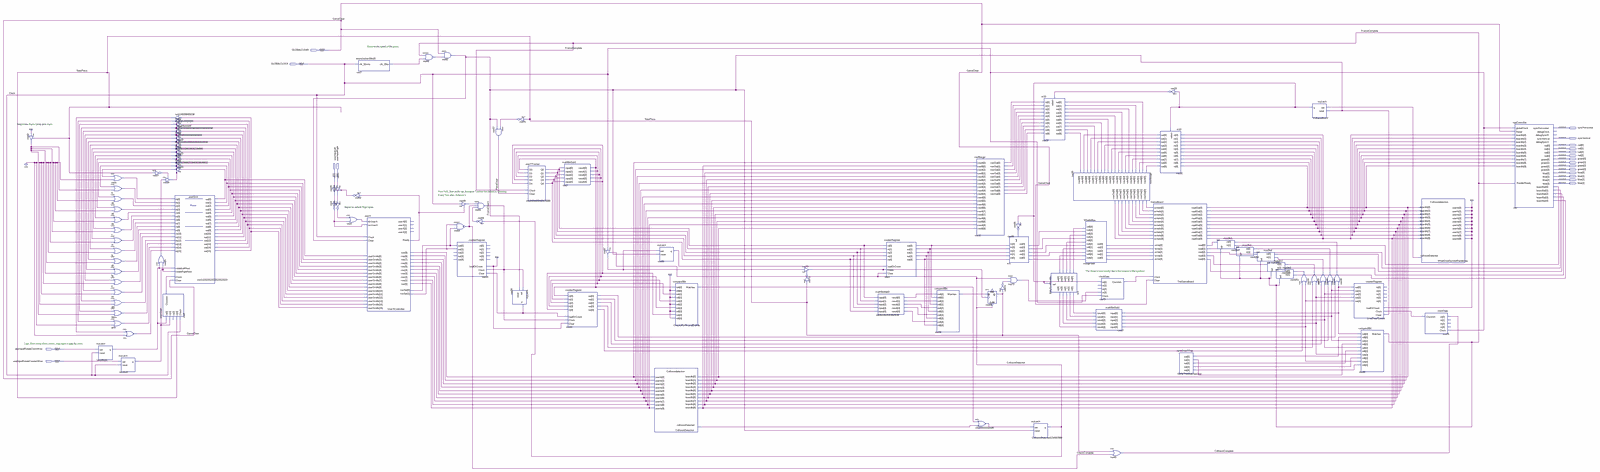
[diagram p0: schematic sheet, whole]
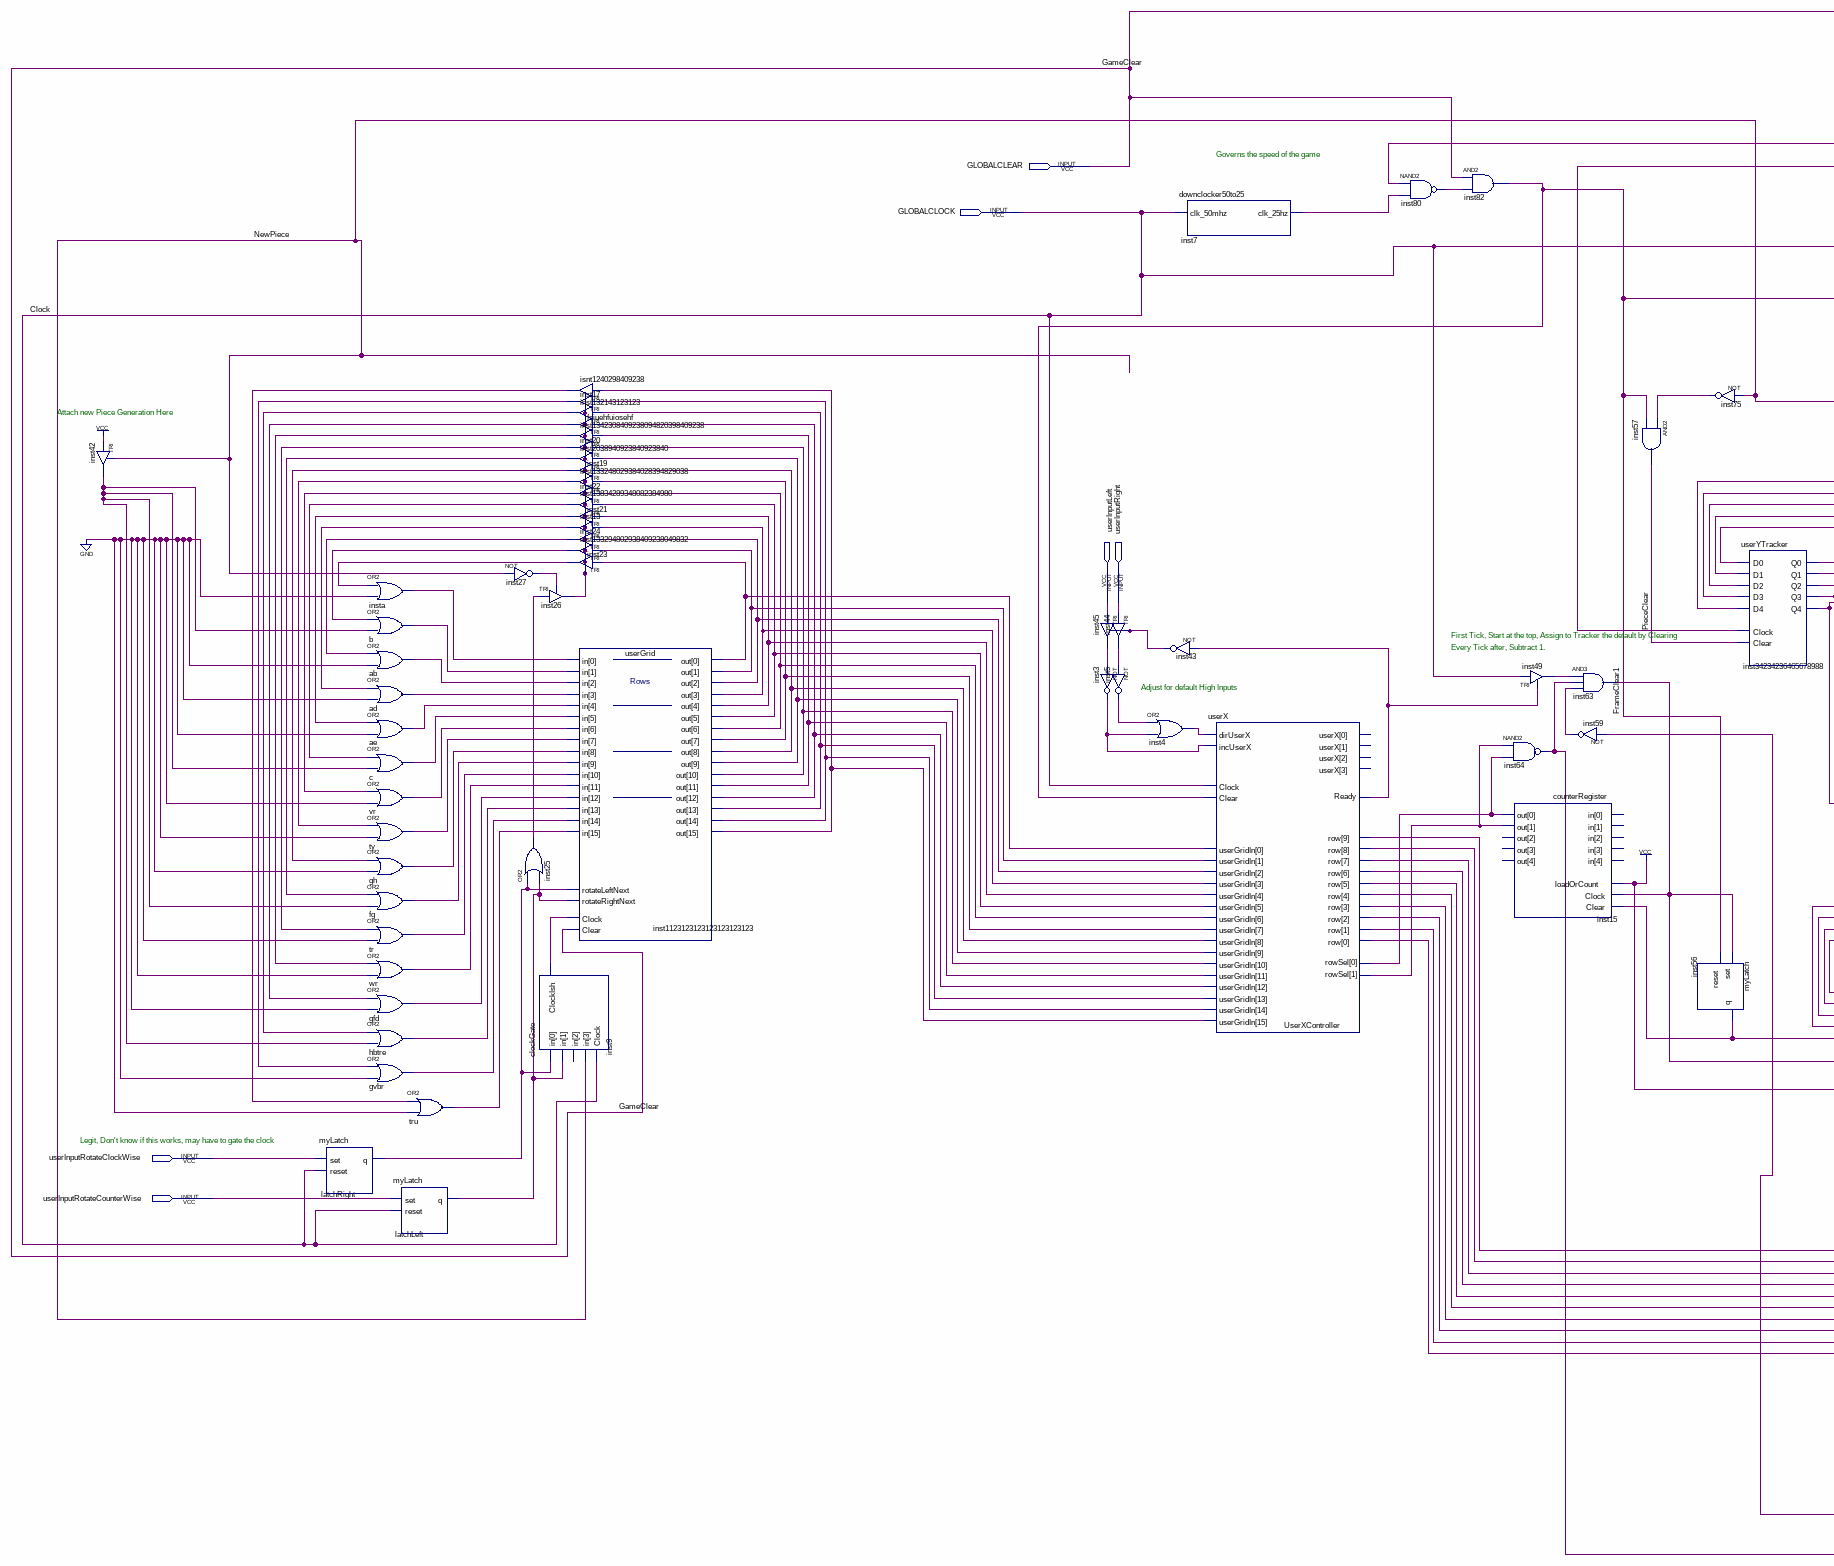
[diagram p1: schematic sheet, left part]
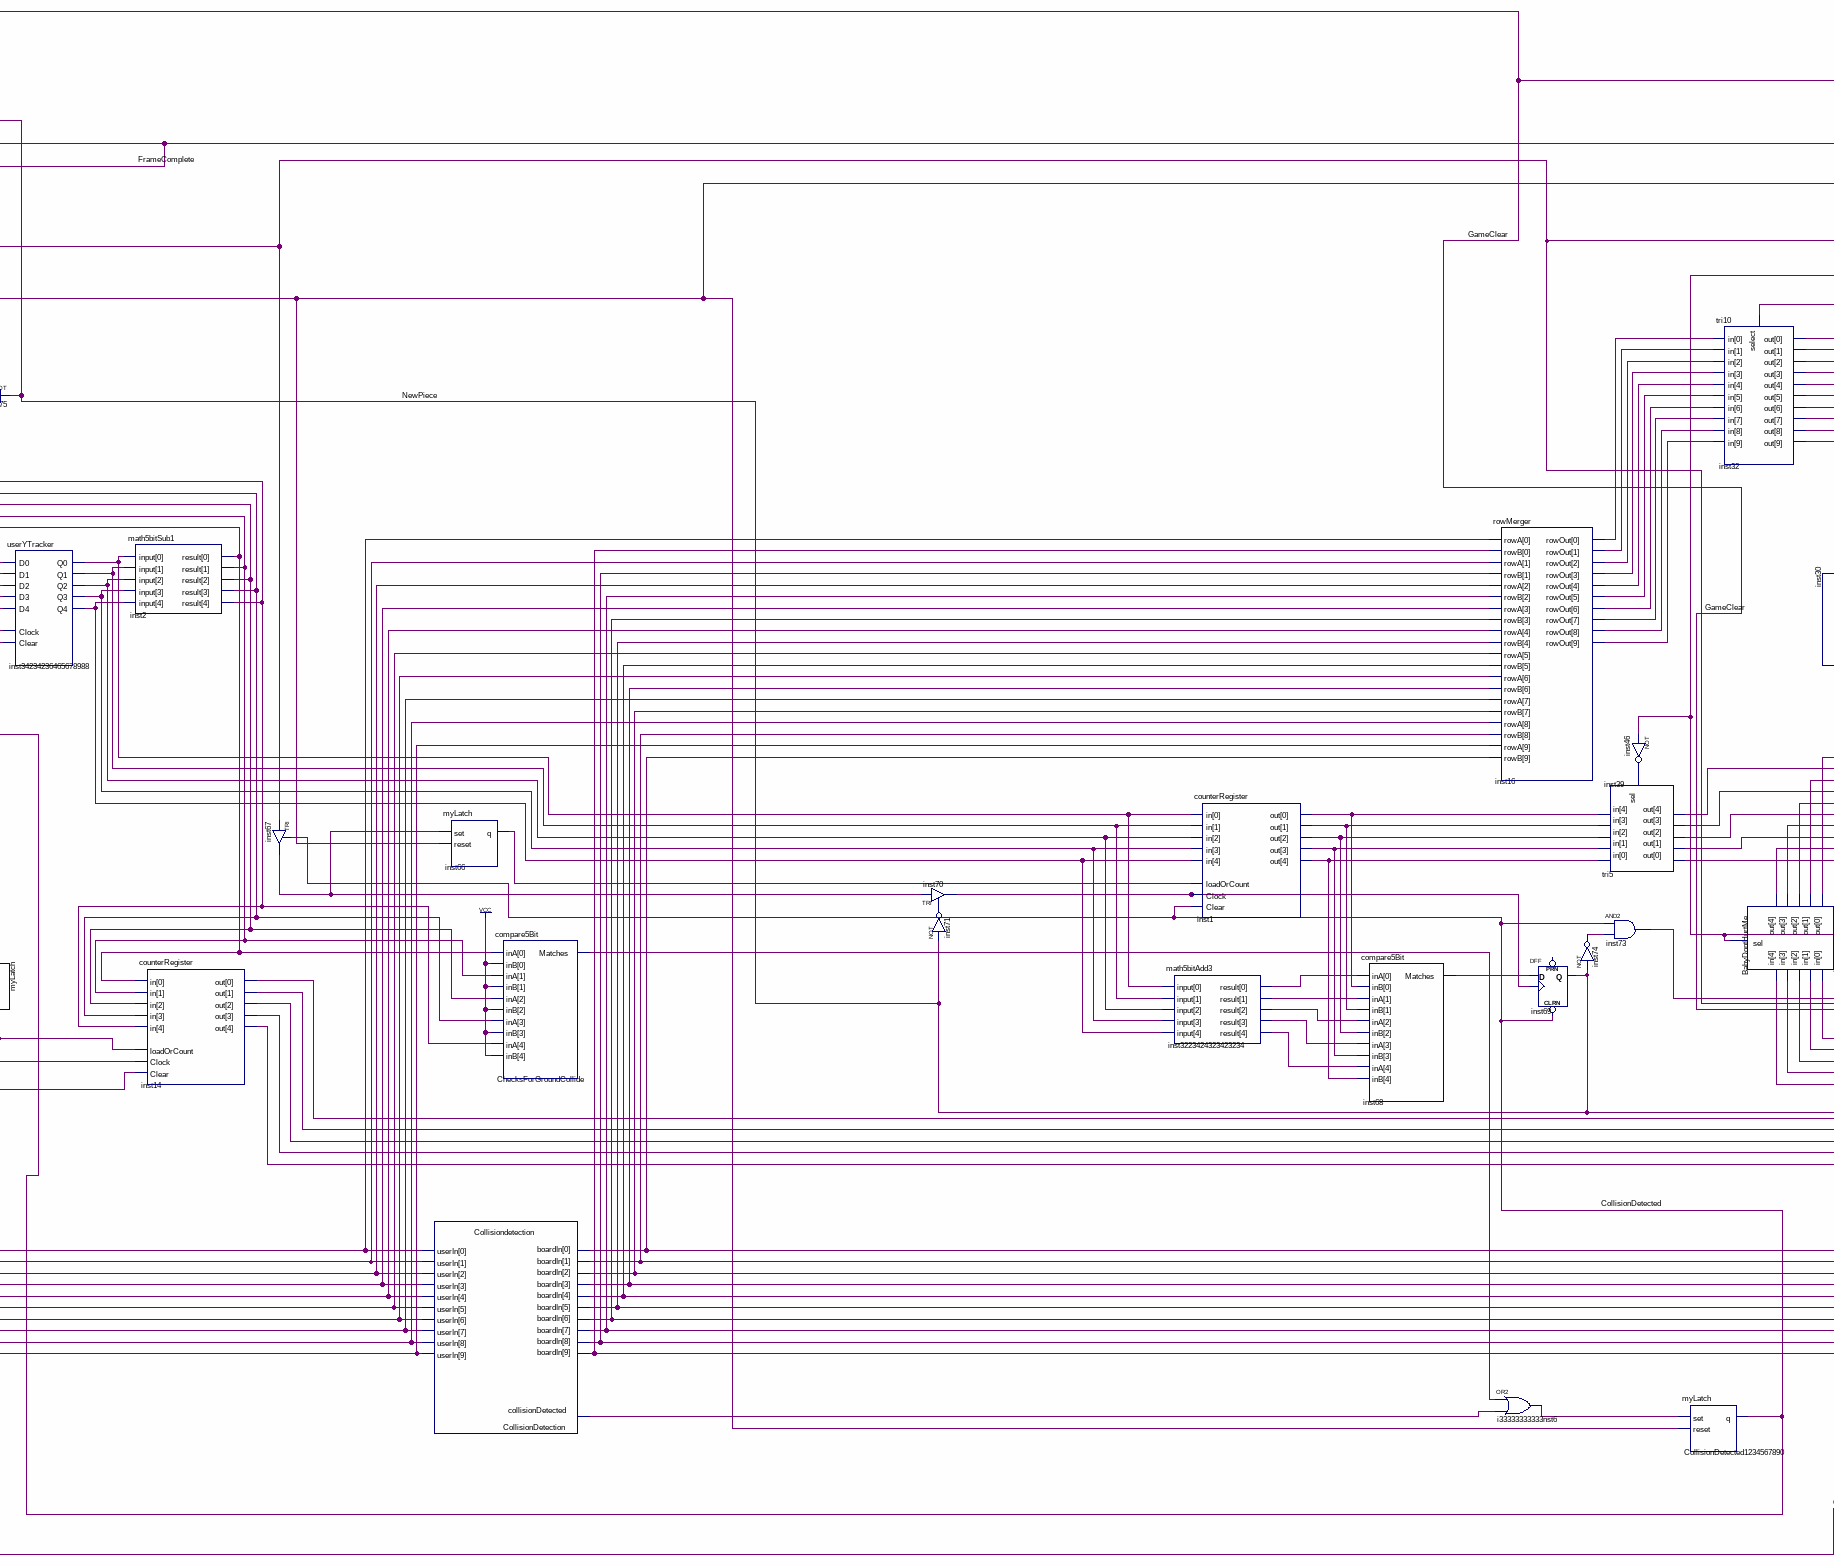
[diagram p2: schematic sheet, centre part]
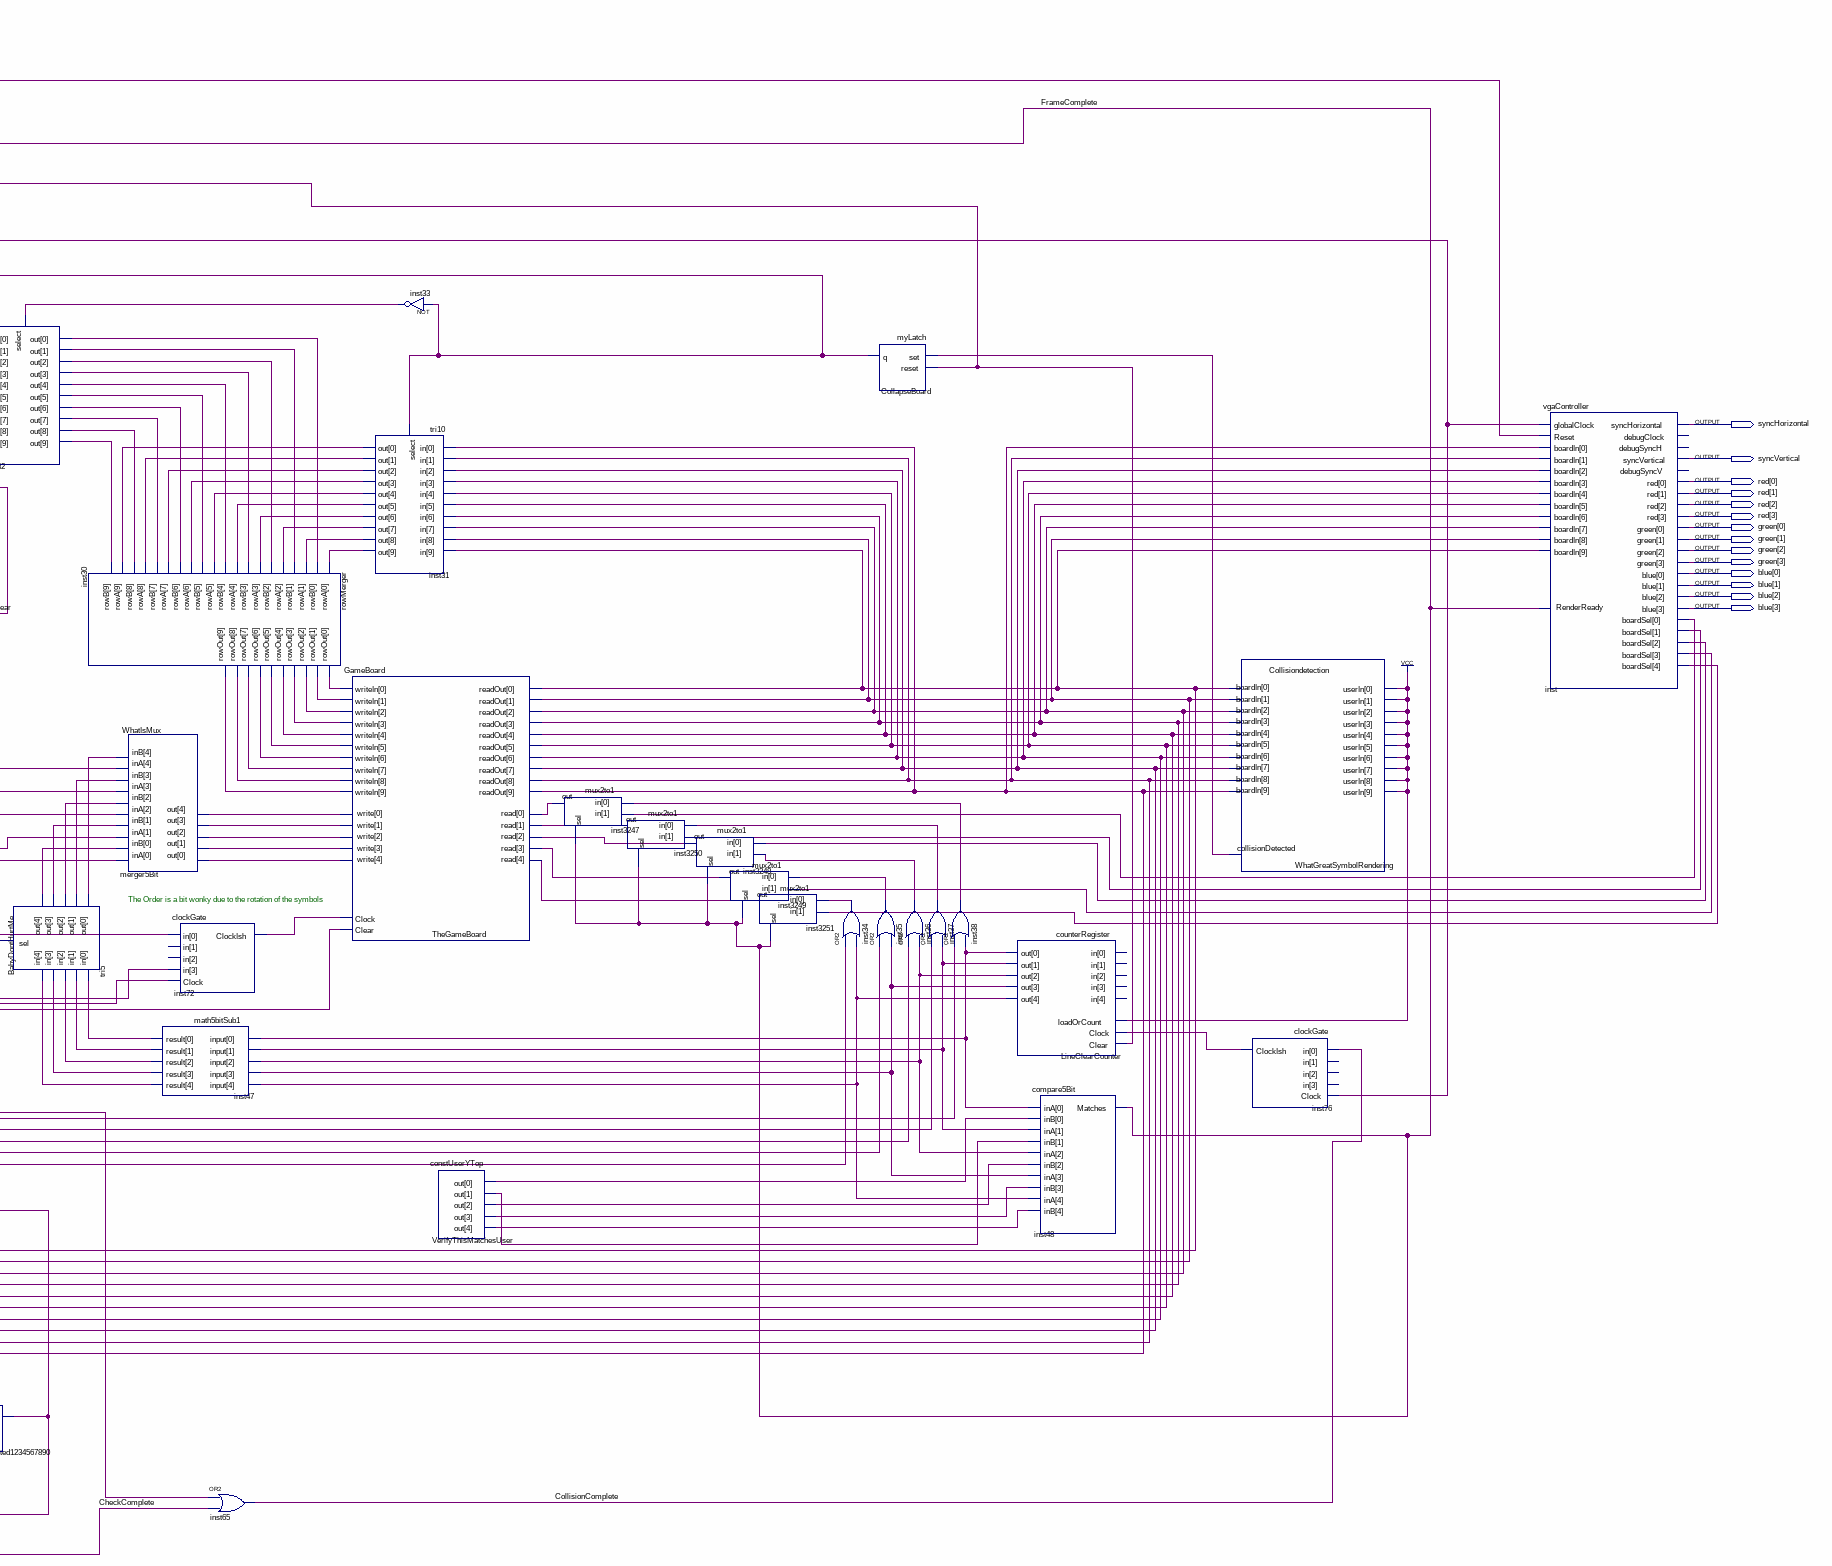
[diagram p3: schematic sheet, right part]
// Quartus schematic GameLogic.bdf as structural Verilog: 105 symbols, 20 pins
module GameLogic (
  input  GLOBALCLEAR,
  input  GLOBALCLOCK,
  input  userInputLeft,
  input  userInputRight,
  input  userInputRotateClockWise,
  input  userInputRotateCounterWise,
  output syncHorizontal,
  output syncVertical,
  output [3:0] red,
  output [3:0] green,
  output [3:0] blue
);

  wire ab_out, ad_out, ae_out, b_out, BabyDontHurtMe_out, BabyDontHurtMe_out_2, BabyDontHurtMe_out_3,
       BabyDontHurtMe_out_4, BabyDontHurtMe_out_5, c_out, CheckComplete, ChecksForGroundCollide_matches,
       CollapseBoard_q, CollisionComplete, CollisionDetected, CollisionDetection_collisiondetected, fg_out,
       FrameClear1, FrameComplete, fsiuehfuiosehf_out, gfd_out, gh_out, gvbr_out, hbtre_out,
       i33333333333nst6_out, inst1_out, inst1_out_2, inst1_out_3, inst1_out_4, inst1_out_5, inst2_result,
       inst2_result_2, inst2_result_3, inst2_result_4, inst2_result_5, inst3_out, inst4_out, inst5_out,
       inst7_clk_25hz, inst9_clockish, inst13_out, inst14_out, inst14_out_2, inst14_out_3, inst14_out_4,
       inst14_out_5, inst15_out, inst15_out_2, inst16_rowout, inst16_rowout_2, inst16_rowout_3,
       inst16_rowout_4, inst16_rowout_5, inst16_rowout_6, inst16_rowout_7, inst16_rowout_8, inst16_rowout_9,
       inst16_rowout_10, inst17_out, inst19_out, inst20_out, inst21_out, inst22_out, inst23_out, inst24_out,
       inst25_out, inst26_out, inst27_out, inst30_rowout, inst30_rowout_2, inst30_rowout_3, inst30_rowout_4,
       inst30_rowout_5, inst30_rowout_6, inst30_rowout_7, inst30_rowout_8, inst30_rowout_9, inst30_rowout_10,
       inst31_out, inst31_out_2, inst31_out_3, inst31_out_4, inst31_out_5, inst31_out_6, inst31_out_7,
       inst31_out_8, inst31_out_9, inst31_out_10, inst32_out, inst32_out_2, inst32_out_3, inst32_out_4,
       inst32_out_5, inst32_out_6, inst32_out_7, inst32_out_8, inst32_out_9, inst32_out_10, inst33_out,
       inst34_out, inst35_out, inst36_out, inst37_out, inst38_out, inst39_out, inst39_out_2, inst39_out_3,
       inst39_out_4, inst39_out_5, inst42_out, inst43_out, inst44_out, inst45_out, inst46_out, inst47_result,
       inst47_result_2, inst47_result_3, inst47_result_4, inst47_result_5, inst49_out, inst56_q, inst59_out,
       inst63_out, inst66_q, inst67_out, inst68_matches, inst70_out, inst71_out, inst72_clockish, inst73_out,
       inst74_out, inst75_out, inst76_clockish, inst80_out, inst3247_out, inst3248_out, inst3249_out,
       inst3250_out, inst3251_out, inst132143123123_out, inst3223424323423234_result,
       inst3223424323423234_result_2, inst3223424323423234_result_3, inst3223424323423234_result_4,
       inst3223424323423234_result_5, inst34234236465678988_q0, inst34234236465678988_q1,
       inst34234236465678988_q2, inst34234236465678988_q3, inst34234236465678988_q4,
       inst2038940923840923840_out, inst13834289348082384980_out, inst1123123123123123123123_out,
       inst1123123123123123123123_out_2, inst1123123123123123123123_out_3, inst1123123123123123123123_out_4,
       inst1123123123123123123123_out_5, inst1123123123123123123123_out_6, inst1123123123123123123123_out_7,
       inst1123123123123123123123_out_8, inst1123123123123123123123_out_9, inst1123123123123123123123_out_10,
       inst1123123123123123123123_out_11, inst1123123123123123123123_out_12,
       inst1123123123123123123123_out_13, inst1123123123123123123123_out_14,
       inst1123123123123123123123_out_15, inst1123123123123123123123_out_16,
       inst133248029384028394829038_out, inst133294802938409238049832_out,
       inst1342308409238094820398409238_out, inst_boardsel, inst_boardsel_2, inst_boardsel_3,
       inst_boardsel_4, inst_boardsel_5, insta_out, isnt1240298409238_out, latchLeft_q, latchRight_q,
       LineClearCounter_out, LineClearCounter_out_2, LineClearCounter_out_3, LineClearCounter_out_4,
       LineClearCounter_out_5, NewPiece, PieceClear, TheGameBoard_readout, TheGameBoard_readout_2,
       TheGameBoard_readout_3, TheGameBoard_readout_4, TheGameBoard_readout_5, TheGameBoard_readout_6,
       TheGameBoard_readout_7, TheGameBoard_readout_8, TheGameBoard_readout_9, TheGameBoard_readout_10,
       tr_out, tru_out, ty_out, UserXController_ready, UserXController_row, UserXController_row_2,
       UserXController_row_3, UserXController_row_4, UserXController_row_5, UserXController_row_6,
       UserXController_row_7, UserXController_row_8, UserXController_row_9, UserXController_row_10,
       VerifyThisMatchesUser_out, VerifyThisMatchesUser_out_2, VerifyThisMatchesUser_out_3,
       VerifyThisMatchesUser_out_4, VerifyThisMatchesUser_out_5, vr_out,
       WhatGreatSymbolRendering_collisiondetected, WhatIsMux_out, WhatIsMux_out_2, WhatIsMux_out_3,
       WhatIsMux_out_4, WhatIsMux_out_5, wr_out;
  wire [4:0] inst15_out_open;  // unused outputs

  TRI inst42 (.IN(1'b1), .OE(NewPiece), .OUT(inst42_out));
  myLatch latchRight (.set(userInputRotateClockWise), .reset(GLOBALCLOCK), .q(latchRight_q));
  or insta (insta_out, inst23_out, 1'b0);
  or b (b_out, inst133294802938409238049832_out, inst42_out);
  or ab (ab_out, inst24_out, 1'b0);
  or ad (ad_out, inst13_out, 1'b0);
  or ae (ae_out, inst21_out, 1'b0);
  or c (c_out, inst13834289348082384980_out, inst42_out);
  or vr (vr_out, inst22_out, 1'b0);
  or ty (ty_out, inst133248029384028394829038_out, 1'b0);
  or gh (gh_out, inst19_out, 1'b0);
  or fg (fg_out, inst2038940923840923840_out, inst42_out);
  or tr (tr_out, inst20_out, 1'b0);
  or wr (wr_out, inst1342308409238094820398409238_out, 1'b0);
  or gfd (gfd_out, fsiuehfuiosehf_out, 1'b0);
  or hbtre (hbtre_out, inst132143123123_out, inst42_out);
  or gvbr (gvbr_out, inst17_out, 1'b0);
  or tru (tru_out, isnt1240298409238_out, 1'b0);
  myLatch latchLeft (.set(userInputRotateCounterWise), .reset(GLOBALCLOCK), .q(latchLeft_q));
  not inst27 (inst27_out, NewPiece);
  or inst25 (inst25_out, latchRight_q, latchLeft_q);
  TRI inst26 (.IN(inst25_out), .OE(inst27_out), .OUT(inst26_out));
  clockGate inst9 (.in({NewPiece, 1'bz, latchLeft_q, latchRight_q}), .Clock(GLOBALCLOCK), .ClockIsh(inst9_clockish));
  TRI isnt1240298409238 (.IN(inst1123123123123123123123_out_16), .OE(inst26_out), .OUT(isnt1240298409238_out));
  TRI inst17 (.IN(inst1123123123123123123123_out_15), .OE(inst26_out), .OUT(inst17_out));
  TRI inst132143123123 (.IN(inst1123123123123123123123_out_14), .OE(inst26_out), .OUT(inst132143123123_out));
  TRI fsiuehfuiosehf (.IN(inst1123123123123123123123_out_13), .OE(inst26_out), .OUT(fsiuehfuiosehf_out));
  TRI inst1342308409238094820398409238 (
    .IN(inst1123123123123123123123_out_12), .OE(inst26_out), .OUT(inst1342308409238094820398409238_out));
  TRI inst20 (.IN(inst1123123123123123123123_out_11), .OE(inst26_out), .OUT(inst20_out));
  TRI inst2038940923840923840 (
    .IN(inst1123123123123123123123_out_10), .OE(inst26_out), .OUT(inst2038940923840923840_out));
  TRI inst19 (.IN(inst1123123123123123123123_out_9), .OE(inst26_out), .OUT(inst19_out));
  TRI inst133248029384028394829038 (
    .IN(inst1123123123123123123123_out_8), .OE(inst26_out), .OUT(inst133248029384028394829038_out));
  TRI inst22 (.IN(inst1123123123123123123123_out_7), .OE(inst26_out), .OUT(inst22_out));
  TRI inst13834289348082384980 (
    .IN(inst1123123123123123123123_out_6), .OE(inst26_out), .OUT(inst13834289348082384980_out));
  TRI inst21 (.IN(inst1123123123123123123123_out_5), .OE(inst26_out), .OUT(inst21_out));
  TRI inst13 (.IN(inst1123123123123123123123_out_4), .OE(inst26_out), .OUT(inst13_out));
  TRI inst24 (.IN(inst1123123123123123123123_out_3), .OE(inst26_out), .OUT(inst24_out));
  TRI inst133294802938409238049832 (
    .IN(inst1123123123123123123123_out_2), .OE(inst26_out), .OUT(inst133294802938409238049832_out));
  TRI inst23 (.IN(inst1123123123123123123123_out), .OE(inst26_out), .OUT(inst23_out));
  userGrid inst1123123123123123123123 (
    .in({tru_out, gvbr_out, hbtre_out, gfd_out, wr_out, tr_out, fg_out, gh_out, ty_out, vr_out, c_out, ae_out, ad_out, ab_out, b_out, insta_out}),
    .Clock(inst9_clockish), .Clear(GLOBALCLEAR), .rotateLeftNext(latchRight_q),
    .rotateRightNext(latchLeft_q),
    .out({inst1123123123123123123123_out_16, inst1123123123123123123123_out_15, inst1123123123123123123123_out_14, inst1123123123123123123123_out_13, inst1123123123123123123123_out_12, inst1123123123123123123123_out_11, inst1123123123123123123123_out_10, inst1123123123123123123123_out_9, inst1123123123123123123123_out_8, inst1123123123123123123123_out_7, inst1123123123123123123123_out_6, inst1123123123123123123123_out_5, inst1123123123123123123123_out_4, inst1123123123123123123123_out_3, inst1123123123123123123123_out_2, inst1123123123123123123123_out}));
  TRI inst44 (.IN(userInputRight), .OE(inst43_out), .OUT(inst44_out));
  TRI inst45 (.IN(userInputLeft), .OE(inst43_out), .OUT(inst45_out));
  not inst3 (inst3_out, inst45_out);
  not inst5 (inst5_out, inst44_out);
  or inst4 (inst4_out, inst5_out, inst3_out);
  downclocker50to25 inst7 (.clk_50mhz(GLOBALCLOCK), .clk_25hz(inst7_clk_25hz));
  not inst43 (inst43_out, UserXController_ready);
  userX UserXController (
    .dirUserX(inst4_out), .Clock(GLOBALCLOCK), .incUserX(inst3_out), .Clear(FrameClear1),
    .userGridIn({inst1123123123123123123123_out_16, inst1123123123123123123123_out_15, inst1123123123123123123123_out_14, inst1123123123123123123123_out_13, inst1123123123123123123123_out_12, inst1123123123123123123123_out_11, inst1123123123123123123123_out_10, inst1123123123123123123123_out_9, inst1123123123123123123123_out_8, inst1123123123123123123123_out_7, inst1123123123123123123123_out_6, inst1123123123123123123123_out_5, inst1123123123123123123123_out_4, inst1123123123123123123123_out_3, inst1123123123123123123123_out_2, inst1123123123123123123123_out}),
    .rowSel({inst15_out_2, inst15_out}),
    .row({UserXController_row_9, UserXController_row_10, UserXController_row_8, UserXController_row_7, UserXController_row_6, UserXController_row_5, UserXController_row_4, UserXController_row_3, UserXController_row_2, UserXController_row}),
    .Ready(UserXController_ready));  // open: userX
  nand inst80 (inst80_out, FrameComplete, inst7_clk_25hz);
  and inst82 (FrameClear1, GLOBALCLEAR, inst80_out);
  TRI inst49 (.IN(GLOBALCLOCK), .OE(UserXController_ready), .OUT(inst49_out));
  nand inst64 (CheckComplete, inst15_out_2, inst15_out);
  counterRegister inst15 (
    .loadOrCount(1'b1), .Clock(inst63_out), .Clear(inst56_q),
    .out({inst15_out_open[4:2], inst15_out_2, inst15_out}));  // open: in
  and inst63 (inst63_out, inst49_out, CheckComplete, inst59_out);
  not inst59 (inst59_out, CollisionDetected);
  and inst57 (PieceClear, inst75_out, FrameClear1);
  not inst75 (inst75_out, NewPiece);
  myLatch inst56 (.set(inst63_out), .reset(FrameClear1), .q(inst56_q));
  userYTracker inst34234236465678988 (
    .D1(inst2_result_2), .D3(inst2_result_4), .D4(inst2_result_5), .D0(inst2_result), .D2(inst2_result_3),
    .Clock(FrameComplete), .Clear(PieceClear), .Q0(inst34234236465678988_q0), .Q1(inst34234236465678988_q1),
    .Q2(inst34234236465678988_q2), .Q3(inst34234236465678988_q3), .Q4(inst34234236465678988_q4));
  math5bitSub1 inst2 (
    .\input ({inst34234236465678988_q4, inst34234236465678988_q3, inst34234236465678988_q2, inst34234236465678988_q1, inst34234236465678988_q0}),
    .result({inst2_result_5, inst2_result_4, inst2_result_3, inst2_result_2, inst2_result}));
  counterRegister inst14 (
    .in({inst2_result_5, inst2_result_4, inst2_result_3, inst2_result_2, inst2_result}),
    .loadOrCount(inst56_q), .Clock(inst63_out), .Clear(1'b1),
    .out({inst14_out_5, inst14_out_4, inst14_out_3, inst14_out_2, inst14_out}));
  TRI inst67 (.IN(GLOBALCLOCK), .OE(CollisionDetected), .OUT(inst67_out));
  Collisiondetection CollisionDetection (
    .userIn({UserXController_row, UserXController_row_2, UserXController_row_3, UserXController_row_4, UserXController_row_5, UserXController_row_6, UserXController_row_7, UserXController_row_8, UserXController_row_10, UserXController_row_9}),
    .boardIn({TheGameBoard_readout_6, TheGameBoard_readout_7, TheGameBoard_readout_8, TheGameBoard_readout_9, TheGameBoard_readout_10, TheGameBoard_readout_5, TheGameBoard_readout_4, TheGameBoard_readout_3, TheGameBoard_readout_2, TheGameBoard_readout}),
    .collisionDetected(CollisionDetection_collisiondetected));
  myLatch inst66 (.set(inst67_out), .reset(FrameClear1), .q(inst66_q));
  compare5Bit ChecksForGroundCollide (
    .inA({inst2_result_5, inst2_result_4, inst2_result_3, inst2_result_2, inst2_result}), .inB({5{1'b1}}),
    .Matches(ChecksForGroundCollide_matches));
  TRI inst70 (.IN(inst67_out), .OE(inst71_out), .OUT(inst70_out));
  not inst71 (inst71_out, NewPiece);
  math5bitAdd3 inst3223424323423234 (
    .\input ({inst34234236465678988_q4, inst34234236465678988_q3, inst34234236465678988_q2, inst34234236465678988_q1, inst34234236465678988_q0}),
    .result({inst3223424323423234_result_5, inst3223424323423234_result_3, inst3223424323423234_result_2, inst3223424323423234_result_4, inst3223424323423234_result}));
  counterRegister inst1 (
    .in({inst34234236465678988_q4, inst34234236465678988_q3, inst34234236465678988_q2, inst34234236465678988_q1, inst34234236465678988_q0}),
    .loadOrCount(inst66_q), .Clock(inst70_out), .Clear(CollisionDetected),
    .out({inst1_out, inst1_out_2, inst1_out_3, inst1_out_4, inst1_out_5}));
  compare5Bit inst68 (
    .inA({inst3223424323423234_result_5, inst3223424323423234_result_3, inst3223424323423234_result_2, inst3223424323423234_result_4, inst3223424323423234_result}),
    .inB({inst1_out, inst1_out_2, inst1_out_3, inst1_out_4, inst1_out_5}), .Matches(inst68_matches));
  rowMerger inst16 (
    .rowA({UserXController_row, UserXController_row_2, UserXController_row_3, UserXController_row_4, UserXController_row_5, UserXController_row_6, UserXController_row_7, UserXController_row_8, UserXController_row_10, UserXController_row_9}),
    .rowB({TheGameBoard_readout, TheGameBoard_readout_2, TheGameBoard_readout_3, TheGameBoard_readout_4, TheGameBoard_readout_5, TheGameBoard_readout_10, TheGameBoard_readout_9, TheGameBoard_readout_8, TheGameBoard_readout_7, TheGameBoard_readout_6}),
    .rowOut({inst16_rowout_7, inst16_rowout_5, inst16_rowout_8, inst16_rowout_4, inst16_rowout_9, inst16_rowout_3, inst16_rowout_10, inst16_rowout_6, inst16_rowout_2, inst16_rowout}));
  DFF inst69 (.CLRN(CollisionDetected), .CLK(inst70_out), .D(inst68_matches), .Q(NewPiece));  // open: PRN
  or i33333333333nst6 (i33333333333nst6_out, ChecksForGroundCollide_matches, CollisionDetection_collisiondetected);
  not inst74 (inst74_out, NewPiece);
  not inst46 (inst46_out, CollapseBoard_q);
  tri5 inst39 (
    .in({inst1_out_5, inst1_out_4, inst1_out_3, inst1_out_2, inst1_out}), .sel(inst46_out),
    .out({inst39_out, inst39_out_2, inst39_out_4, inst39_out_3, inst39_out_5}));
  and inst73 (inst73_out, CollisionDetected, inst74_out);
  tri10 inst32 (
    .in({inst16_rowout_7, inst16_rowout_5, inst16_rowout_8, inst16_rowout_4, inst16_rowout_9, inst16_rowout_3, inst16_rowout_10, inst16_rowout_6, inst16_rowout_2, inst16_rowout}),
    .select(inst33_out),
    .out({inst32_out, inst32_out_2, inst32_out_3, inst32_out_4, inst32_out_5, inst32_out_6, inst32_out_7, inst32_out_8, inst32_out_9, inst32_out_10}));
  myLatch CollisionDetected1234567890 (.set(i33333333333nst6_out), .reset(FrameClear1), .q(CollisionDetected));
  tri5 BabyDontHurtMe (
    .in({inst47_result_4, inst47_result_3, inst47_result_2, inst47_result, inst47_result_5}),
    .sel(CollapseBoard_q),
    .out({BabyDontHurtMe_out_5, BabyDontHurtMe_out_4, BabyDontHurtMe_out, BabyDontHurtMe_out_3, BabyDontHurtMe_out_2}));
  rowMerger inst30 (
    .rowA({inst31_out_10, inst31_out_9, inst31_out_8, inst31_out_7, inst31_out_6, inst31_out_5, inst31_out_4, inst31_out_3, inst31_out_2, inst31_out}),
    .rowB({inst32_out, inst32_out_2, inst32_out_3, inst32_out_4, inst32_out_5, inst32_out_6, inst32_out_7, inst32_out_8, inst32_out_9, inst32_out_10}),
    .rowOut({inst30_rowout_10, inst30_rowout_9, inst30_rowout_8, inst30_rowout_7, inst30_rowout_6, inst30_rowout_5, inst30_rowout_4, inst30_rowout_3, inst30_rowout_2, inst30_rowout}));
  merger5Bit WhatIsMux (
    .inA({inst39_out, inst39_out_2, inst39_out_4, inst39_out_3, inst39_out_5}),
    .inB({BabyDontHurtMe_out_2, BabyDontHurtMe_out_3, BabyDontHurtMe_out, BabyDontHurtMe_out_4, BabyDontHurtMe_out_5}),
    .out({WhatIsMux_out_2, WhatIsMux_out, WhatIsMux_out_3, WhatIsMux_out_4, WhatIsMux_out_5}));
  clockGate inst72 (.in({inst73_out, 2'bzz, CollapseBoard_q}), .Clock(GLOBALCLOCK), .ClockIsh(inst72_clockish));
  math5bitSub1 inst47 (
    .\input ({LineClearCounter_out_5, LineClearCounter_out_4, LineClearCounter_out_3, LineClearCounter_out, LineClearCounter_out_2}),
    .result({inst47_result_4, inst47_result_3, inst47_result_2, inst47_result, inst47_result_5}));
  or inst65 (CollisionComplete, NewPiece, CheckComplete);
  GameBoard TheGameBoard (
    .writeIn({inst30_rowout_10, inst30_rowout_9, inst30_rowout_8, inst30_rowout_7, inst30_rowout_6, inst30_rowout_5, inst30_rowout_4, inst30_rowout_3, inst30_rowout_2, inst30_rowout}),
    .Clock(inst72_clockish), .Clear(GLOBALCLEAR),
    .write({WhatIsMux_out_5, WhatIsMux_out_4, WhatIsMux_out_3, WhatIsMux_out, WhatIsMux_out_2}),
    .read({inst3251_out, inst3249_out, inst3248_out, inst3250_out, inst3247_out}),
    .readOut({TheGameBoard_readout_6, TheGameBoard_readout_7, TheGameBoard_readout_8, TheGameBoard_readout_9, TheGameBoard_readout_10, TheGameBoard_readout_5, TheGameBoard_readout_4, TheGameBoard_readout_3, TheGameBoard_readout_2, TheGameBoard_readout}));
  not inst33 (inst33_out, CollapseBoard_q);
  tri10 inst31 (
    .in({TheGameBoard_readout, TheGameBoard_readout_2, TheGameBoard_readout_3, TheGameBoard_readout_4, TheGameBoard_readout_5, TheGameBoard_readout_10, TheGameBoard_readout_9, TheGameBoard_readout_8, TheGameBoard_readout_7, TheGameBoard_readout_6}),
    .select(CollapseBoard_q),
    .out({inst31_out, inst31_out_2, inst31_out_3, inst31_out_4, inst31_out_5, inst31_out_6, inst31_out_7, inst31_out_8, inst31_out_9, inst31_out_10}));
  constUserYTop VerifyThisMatchesUser (.out({VerifyThisMatchesUser_out_5, VerifyThisMatchesUser_out_4, VerifyThisMatchesUser_out_3, VerifyThisMatchesUser_out, VerifyThisMatchesUser_out_2}));
  mux2to1 inst3247 (.in({inst_boardsel, inst38_out}), .sel(FrameComplete), .out(inst3247_out));
  mux2to1 inst3250 (.in({inst_boardsel_2, inst37_out}), .sel(FrameComplete), .out(inst3250_out));
  mux2to1 inst3248 (.in({inst36_out, inst_boardsel_3}), .sel(FrameComplete), .out(inst3248_out));
  mux2to1 inst3249 (.in({inst_boardsel_4, inst35_out}), .sel(FrameComplete), .out(inst3249_out));
  mux2to1 inst3251 (.in({inst_boardsel_5, inst34_out}), .sel(FrameComplete), .out(inst3251_out));
  or inst34 (inst34_out, inst14_out_5, LineClearCounter_out_5);
  myLatch CollapseBoard (.set(WhatGreatSymbolRendering_collisiondetected), .reset(FrameClear1), .q(CollapseBoard_q));
  or inst35 (inst35_out, inst14_out_4, LineClearCounter_out_4);
  or inst36 (inst36_out, inst14_out_3, LineClearCounter_out_3);
  or inst37 (inst37_out, inst14_out_2, LineClearCounter_out);
  or inst38 (inst38_out, inst14_out, LineClearCounter_out_2);
  counterRegister LineClearCounter (
    .loadOrCount(1'b1), .Clock(inst76_clockish), .Clear(FrameClear1),
    .out({LineClearCounter_out_5, LineClearCounter_out_4, LineClearCounter_out_3, LineClearCounter_out, LineClearCounter_out_2}));  // open: in
  compare5Bit inst48 (
    .inA({LineClearCounter_out_5, LineClearCounter_out_4, LineClearCounter_out_3, LineClearCounter_out, LineClearCounter_out_2}),
    .inB({VerifyThisMatchesUser_out_5, VerifyThisMatchesUser_out_4, VerifyThisMatchesUser_out_3, VerifyThisMatchesUser_out, VerifyThisMatchesUser_out_2}),
    .Matches(FrameComplete));
  Collisiondetection WhatGreatSymbolRendering (
    .userIn({10{1'b1}}),
    .boardIn({TheGameBoard_readout_6, TheGameBoard_readout_7, TheGameBoard_readout_8, TheGameBoard_readout_9, TheGameBoard_readout_10, TheGameBoard_readout_5, TheGameBoard_readout_4, TheGameBoard_readout_3, TheGameBoard_readout_2, TheGameBoard_readout}),
    .collisionDetected(WhatGreatSymbolRendering_collisiondetected));
  clockGate inst76 (.in({3'bzzz, CollisionComplete}), .Clock(GLOBALCLOCK), .ClockIsh(inst76_clockish));
  vgaController inst (
    .globalClock(GLOBALCLOCK), .Reset(GLOBALCLEAR),
    .boardIn({TheGameBoard_readout, TheGameBoard_readout_2, TheGameBoard_readout_3, TheGameBoard_readout_4, TheGameBoard_readout_5, TheGameBoard_readout_10, TheGameBoard_readout_9, TheGameBoard_readout_8, TheGameBoard_readout_7, TheGameBoard_readout_6}),
    .RenderReady(FrameComplete), .syncHorizontal(syncHorizontal), .syncVertical(syncVertical), .red(red),
    .green(green), .blue(blue),
    .boardSel({inst_boardsel_5, inst_boardsel_4, inst_boardsel_3, inst_boardsel_2, inst_boardsel}));  // open: debugClock, debugSyncH, debugSyncV

  // Other names for the same wires on the sheet: Clock = GLOBALCLOCK; GameClear = GLOBALCLEAR

  // Notes on the sheet:
  //   Governs the speed of the game
  //   Attach new Piece Generation Here
  //   First Tick, Start at the top, Assign to Tracker the default by Clearing
  //   Every Tick after, Subtract 1.
  //   Adjust for default High Inputs
  //   The Order is a bit wonky due to the rotation of the symbols
  //   Legit, Don't know if this works, may have to gate the clock
endmodule
